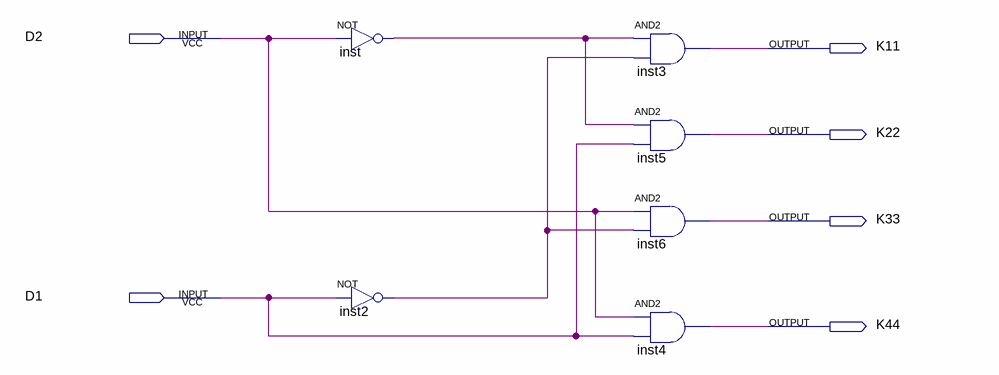
[diagram p0: schematic sheet]
// Quartus schematic Block6.bdf as structural Verilog: 6 symbols, 6 pins
module Block6 (
  input  D2,
  input  D1,
  output K11,
  output K22,
  output K33,
  output K44
);

  wire inst2_out, inst_out;

  not inst (inst_out, D2);
  not inst2 (inst2_out, D1);
  and inst3 (K11, inst_out, inst2_out);
  and inst5 (K22, inst_out, D1);
  and inst6 (K33, D2, inst2_out);
  and inst4 (K44, D2, D1);
endmodule
